# Altium project AUAV X05.PrjPcb (part 1 of 2)
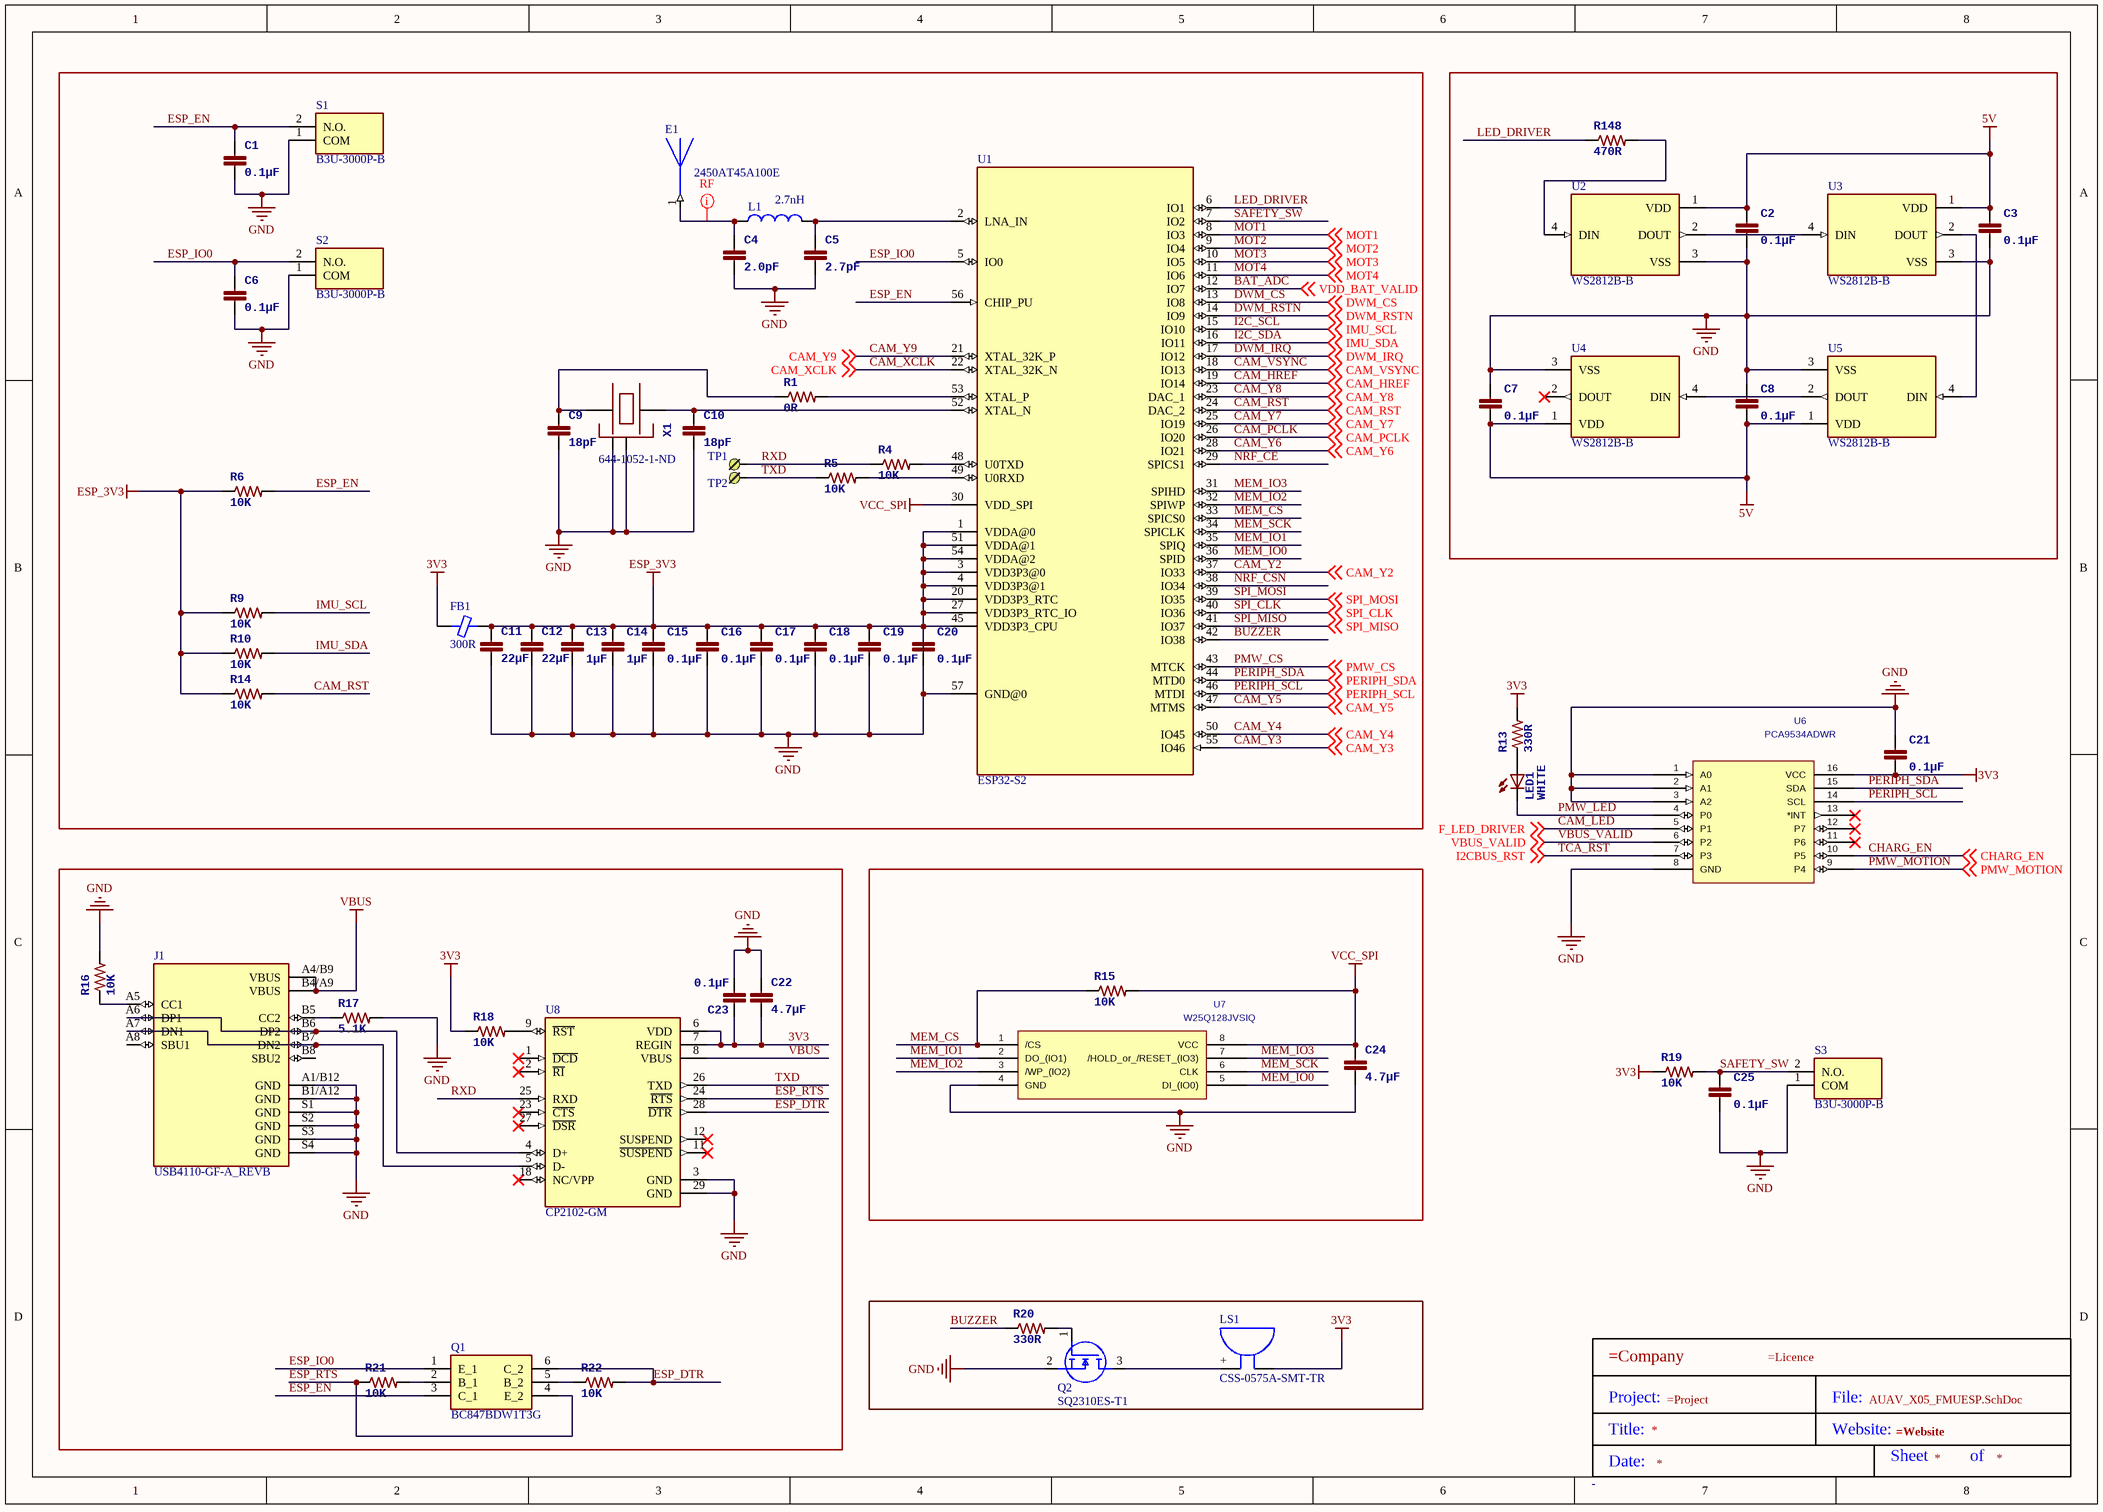
[diagram p0: AUAV_X05_FMUESP.SchDoc]
10 sheets, 386 parts. Net scope: global (net labels, ports and power ports of the same name join across sheets).
Board file: AUAV_X05.PcbDoc
Sheets:
  AUAV_X05_FMUESP.SchDoc
  AUAV_X05_IMU.SchDoc
  AUAV_X05_POWER.SchDoc
  AUAV_X05_CAM.SchDoc
  AUAV_X05_ToF.SchDoc
  AUAV_X05_NRF24.SchDoc
  AUAV_X05_UWB.SchDoc
  AUAV_X05_PMW3901.SchDoc
  AUAV_X05_GPS.SchDoc
  AUAV_X05_ESC.SchDoc

## Sheet AUAV_X05_FMUESP.SchDoc
size A3

### Parts
(Parts that share a designator on the sheet are numbered #1, #2 ... from top to bottom, then left to right.)
*?#1  Title Block  (value not drawn)
C1  0.1µF  [0402-CAP]
C2  0.1µF  [0402-CAP]
C3  0.1µF  [0402-CAP]
C4  2.0pF  [0402-CAP]
C5  2.7pF  [0402-CAP]
C6  0.1µF  [0402-CAP]
C7  0.1µF  [0402-CAP]
C8  0.1µF  [0402-CAP]
C9  18pF  [0402-CAP]
C10  18pF  [0402-CAP]
C11  22µF  [0805-CAP]
C12  22µF  [0805-CAP]
C13  1µF  [0402-CAP]
C14  1µF  [0402-CAP]
C15  0.1µF  [0402-CAP]
C16  0.1µF  [0402-CAP]
C17  0.1µF  [0402-CAP]
C18  0.1µF  [0402-CAP]
C19  0.1µF  [0402-CAP]
C20  0.1µF  [0402-CAP]
C21  0.1µF  [0402-CAP]
C22  4.7µF  [0603-CAP]
C23  0.1µF  [0402-CAP]
C24  4.7µF  [0603-CAP]
C25  0.1µF  [0402-CAP]
E1  2450AT45A100E  [ANT_2450AT45A100E]
FB1  300R  [FER 0402_1005]
J1  USB4110-GF-A_REVB  [GCT_USB4110-GF-A_REVB]
L1  2.7nH  [INDC1005X65N]
LED1  WHITE  [0603-LED]
LS1  CSS-0575A-SMT-TR  [CUI CSS-0575A-SMT-TR]
Q1  BC847BDW1T3G  [SOT65P210X110-6N]
Q2  SQ2310ES-T1  [SOT95P237X112-3N]
R1  0R  [0402-RES]
R4  10K  [0402-RES]
R5  10K  [0402-RES]
R6  10K  [0402-RES]
R9  10K  [0402-RES]
R10  10K  [0402-RES]
R13  330R  [0402-RES]
R14  10K  [0402-RES]
R15  10K  [0402-RES]
R16  10K  [0402-RES]
R17  5.1K  [0402-RES]
R18  10K  [0402-RES]
R19  10K  [0402-RES]
R20  330R  [0402-RES]
R21  10K  [0402-RES]
R22  10K  [0402-RES]
R148  470R  [0402-RES]
S1  B3U-3000P-B  [B3U3000PB]
S2  B3U-3000P-B  [B3U3000PB]
S3  B3U-3000P-B  [B3U3000PB]
TP1  TP  [SMT_PAD]  (value not drawn)
TP2  TP  [SMT_PAD]  (value not drawn)
U1  ESP32-S2  [QFN40P700X700X90-57T400N]
U2  WS2812B-B  [LED_WS2812B-B]
U3  WS2812B-B  [LED_WS2812B-B]
U4  WS2812B-B  [LED_WS2812B-B]
U5  WS2812B-B  [LED_WS2812B-B]
U6  PCA9534ADWR  [DW16]
U7  W25Q128JVSIQ  [SOIC_128JVSIQ_WI]
U8  CP2102-GM  [QFN50P500X500X100-29N]
X1  Supplier Part Number 1: 644-1052-1-ND  [OSCILLATOR-3.2X2.5]  (hidden comment: Crystal Oscillator in 3.2x2.5 SMD)

### Nets
3V3: C21.P$2 C22.P$2 C23.P$1 FB1.1 LS1.- R13.P$2 R18.P$1 R19.P$1 U6.16(VCC) U8.6(VDD) U8.7(REGIN)
5V: C2.P$1 C3.P$1 C7.P$2 C8.P$2 U2.1(VDD) U3.1(VDD) U4.1(VDD) U5.1(VDD)
ESP_3V3: C11.P$1 C12.P$1 C13.P$1 C14.P$1 C15.P$1 C16.P$1 C17.P$1 C18.P$1 C19.P$1 C20.P$1 FB1.2 R6.P$1 R9.P$1 R10.P$1 R14.P$1 U1.1(VDDA@0) U1.3(VDD3P3@0) U1.4(VDD3P3@1) U1.20(VDD3P3_RTC) U1.27(VDD3P3_RTC_IO) U1.45(VDD3P3_CPU) U1.51(VDDA@1) U1.54(VDDA@2)
GND: C1.P$2 C2.P$2 C3.P$2 C4.P$2 C5.P$2 C6.P$2 C7.P$1 C8.P$1 C9.P$2 C10.P$2 C11.P$2 C12.P$2 C13.P$2 C14.P$2 C15.P$2 C16.P$2 C17.P$2 C18.P$2 C19.P$2 C20.P$2 C21.P$1 C22.P$1 C23.P$2 C24.P$2 C25.P$2 J1.A1/B12(GND) J1.B1/A12(GND) J1.S1(GND) J1.S2(GND) J1.S3(GND) J1.S4(GND) Q2.2(S) R16.P$2 R17.P$2 S1.1(COM) S2.1(COM) S3.1(COM) U1.57(GND@0) U2.3(VSS) U3.3(VSS) U4.3(VSS) U5.3(VSS) U6.1(A0) U6.2(A1) U6.3(A2) U6.8(GND) U7.4(GND) U8.3(GND) U8.29(GND) X1.2(NC_2) X1.4(NC_4)
VBUS: J1.A4/B9(VBUS) J1.B4/A9(VBUS) U8.8(VBUS)
VCC_SPI: C24.P$1 R15.P$2 U1.30(VDD_SPI) U7.8(VCC)
BAT_ADC: U1.12(IO7) ; off-sheet VDD_BAT_VALID  [also labelled VDD_BAT_VALID]
BUZZER: R20.P$1 U1.42(IO38)
CAM_HREF: U1.19(IO14) ; off-sheet CAM_HREF
CAM_LED: U6.5(P1) ; off-sheet F_LED_DRIVER  [also labelled F_LED_DRIVER]
CAM_PCLK: U1.26(IO20) ; off-sheet CAM_PCLK
CAM_RST: R14.P$2 U1.24(DAC_2) ; off-sheet CAM_RST
CAM_VSYNC: U1.18(IO13) ; off-sheet CAM_VSYNC
CAM_XCLK: U1.22(XTAL_32K_N) ; off-sheet CAM_XCLK
CAM_Y2: U1.37(IO33) ; off-sheet CAM_Y2
CAM_Y3: U1.55(IO46) ; off-sheet CAM_Y3
CAM_Y4: U1.50(IO45) ; off-sheet CAM_Y4
CAM_Y5: U1.47(MTMS) ; off-sheet CAM_Y5
CAM_Y6: U1.28(IO21) ; off-sheet CAM_Y6
CAM_Y7: U1.25(IO19) ; off-sheet CAM_Y7
CAM_Y8: U1.23(DAC_1) ; off-sheet CAM_Y8
CAM_Y9: U1.21(XTAL_32K_P) ; off-sheet CAM_Y9
CHARG_EN: U6.10(P5) ; off-sheet CHARG_EN
DWM_CS: U1.13(IO8) ; off-sheet DWM_CS
DWM_IRQ: U1.17(IO12) ; off-sheet DWM_IRQ
DWM_RSTN: U1.14(IO9) ; off-sheet DWM_RSTN
ESP_DTR: Q1.6(C_2) R22.P$2 U8.28(~{DTR})
ESP_EN: C1.P$1 Q1.3(C_1) R6.P$2 S1.2(N.O.) U1.56(CHIP_PU)
ESP_IO0: C6.P$1 Q1.1(E_1) S2.2(N.O.) U1.5(IO0)
ESP_RTS: Q1.4(E_2) R21.P$1 U8.24(~{RTS})
I2C_SCL: R9.P$2 U1.15(IO10) ; off-sheet IMU_SCL  [also labelled IMU_SCL]
I2C_SDA: R10.P$2 U1.16(IO11) ; off-sheet IMU_SDA  [also labelled IMU_SDA]
LED_DRIVER: R148.P$1 U1.6(IO1)
MEM_CS: R15.P$1 U1.33(SPICS0) U7.1(/CS)
MEM_IO0: U1.36(SPID) U7.5(DI_(IO0))
MEM_IO1: U1.35(SPIQ) U7.2(DO_(IO1))
MEM_IO2: U1.32(SPIWP) U7.3(/WP_(IO2))
MEM_IO3: U1.31(SPIHD) U7.7(/HOLD_or_/RESET_(IO3))
MEM_SCK: U1.34(SPICLK) U7.6(CLK)
MOT1: U1.8(IO3) ; off-sheet MOT1  [project net ESC1_PWM]
MOT2: U1.9(IO4) ; off-sheet MOT2  [project net ESC2_PWM]
MOT3: U1.10(IO5) ; off-sheet MOT3  [project net ESC3_PWM]
MOT4: U1.11(IO6) ; off-sheet MOT4  [project net ESC4_PWM]
NRF_CE: U1.29(SPICS1)
NRF_CSN: U1.38(IO34)
PERIPH_SCL: U1.46(MTDI) U6.14(SCL) ; off-sheet PERIPH_SCL
PERIPH_SDA: U1.44(MTD0) U6.15(SDA) ; off-sheet PERIPH_SDA
PMW_CS: U1.43(MTCK) ; off-sheet PMW_CS
PMW_LED: LED1.C U6.4(P0)
PMW_MOTION: U6.9(P4) ; off-sheet PMW_MOTION
RXD: R4.P$1 TP1.1 U8.25(RXD)
SAFETY_SW: C25.P$1 R19.P$2 S3.2(N.O.) U1.7(IO2)
SPI_CLK: U1.40(IO36) ; off-sheet SPI_CLK
SPI_MISO: U1.41(IO37) ; off-sheet SPI_MISO
SPI_MOSI: U1.39(IO35) ; off-sheet SPI_MOSI
TCA_RST: U6.7(P3) ; off-sheet I2CBUS_RST  [also labelled I2CBUS_RST]
TXD: R5.P$1 TP2.1 U8.26(TXD)
VBUS_VALID: U6.6(P2) ; off-sheet VBUS_VALID
NetC4_P$1: C4.P$1 E1.1 L1.1
NetC5_P$1: C5.P$1 L1.2 U1.2(LNA_IN)
NetC9_P$1: C9.P$1 R1.P$1 X1.1
NetC10_P$1: C10.P$1 U1.52(XTAL_N) X1.3
NetJ1_A5: J1.A5(CC1) R16.P$1
NetJ1_A6: J1.A6(DP1) J1.B6(DP2) U8.4(D+)
NetJ1_A7: J1.A7(DN1) J1.B7(DN2) U8.5(D-)
NetJ1_B5: J1.B5(CC2) R17.P$1
NetLED1_A: LED1.A R13.P$1
NetLS1_+: LS1.+ Q2.3(D)
NetQ1_2: Q1.2(B_1) R21.P$2
NetQ1_5: Q1.5(B_2) R22.P$1
NetQ2_1: Q2.1(G) R20.P$2
NetR1_P$2: R1.P$2 U1.53(XTAL_P)
NetR4_P$2: R4.P$2 U1.48(U0TXD)
NetR5_P$2: R5.P$2 U1.49(U0RXD)
NetR18_P$2: R18.P$2 U8.9(~{RST})
NetR148_P$2: R148.P$2 U2.4(DIN)
NetU2_2: U2.2(DOUT) U3.4(DIN)
NetU3_2: U3.2(DOUT) U5.4(DIN)
NetU4_4: U4.4(DIN) U5.2(DOUT)

Not connected (* = marked no-connect by the designer): J1 A8(SBU1) B8(SBU2); U4 2(DOUT)*; U6 11(P6)* 12(P7)* 13(*INT)*; U8 1(~{DCD})* 2(~{RI})* 11(~{SUSPEND})* 12(SUSPEND)* 18(NC/VPP)* 23(~{CTS})* 27(~{DSR})*

### Layout directives
net class RF: NetC4_P$1

### Notes on the sheet
- (in symbol Title Block) Project:; File:; Title:; Website:; Sheet; of; Date:

### Library data of the parts
C1-C10 C13-C21 C23 C25 = CAP0402: CAP CER 8PF 50V C0G 0402; PARTNO: C1005C0G1H080C; 3DR_PARTNO: ECM0710; Value: 8p; Supplier 1: Digi-Key; Supplier Part Number 1: 445-4890-1-ND
C11 C12 = CAP0805: CAP CER 4.7UF 16V 10% X7R 0805; PARTNO: CL21B475KOFNNNE; 3DR_PARTNO: ECM0622; Value: 4u7; DATASHEET: http://www.digikey.com/product-detail/en/CL21B475KOFNNNE/1276-2873-2-ND/3888531; Supplier 1: Digi-Key; Supplier Part Number 1: 1276-2873-1-ND
C22 C24 = CAP0603: CAP CER 2.2UF 16V 10% X6S 0603; PARTNO: C1608X6S1C225K080AC; 3DR_PARTNO: ECM0619; Value: 2u2; Supplier 1: Digi-Key; Supplier Part Number 1: 445-7438-1-ND
E1 = 2450AT45A100E: 2.4GHz Chip RF Antenna 2.4GHz ~ 2.5GHz 2.2dBi Solder Surface Mount; MF: Johanson Technology; Price: None; MP: 2450AT45A100E; Value: *; Package: FBGA-1152 Johanson Technology; SnapEDA_Link: https://www.snapeda.com/parts/2450AT45A100E/Johanson%20Technology%20Inc./view-part/105265/?ref=snap; Availability: Unavailable
FB1 = BLM15EX331SN1D: 0402 (1005) 330OHM 25% 1100MA; Manufacturer: Murata Electronics; Current Rating (Max): 1.1A; Filter Type: Signal Line; Number of Lines: 1; Part Number: BLM15EX331SN1D; ComponentLink1Description: Datasheet; ComponentLink1URL: https://www.murata.com/en-us/products/productdata/8796750970910/ENFA0023.pdf; ComponentLink2Description: DigiKey Link; ComponentLink2URL: http://digikey.com/product-detail/en/murata-electronics/BLM15EX331SN1D/490-18371-1-ND/9955444; Device Package: 0402 (1005 Metric); Height (Max): 0.022" (0.55mm); LastUpdated: 02-09-2020 01:18:11; Lifecycle Status: Active; Minimum Order: 1; Mounting Type: Surface Mount; Operating Temperature: -55°C ~ 125°C; Package / Case: 0402 (1005 Metric); Packaging: TapeAndReel; PartId: 364; Part Status: Active; Price: 0.06; Series: *; Size / Dimension: 0.039" L x 0.022" W (1.00mm x 0.55mm); Supplier 1: DigiKey; Supplier Part Number 1: 490-18371-1-ND
J1 = USB4110-GF-A_REVB: USB-C (USB TYPE-C) USB 2.0 Receptacle Connector 24 (16+8 Dummy) Position Surface Mount, Right Angle; Through Hole; MF: GCT; Value: *; Price: None; Package: None; SnapEDA_Link: https://www.snapeda.com/parts/USB4110-GF-A/Global%20Connector%20Technology/view-part/4001167/?ref=snap; Availability: Warning; MP: USB4110-GF-A; Purchase-URL: https://pricing.snapeda.com/search/part/USB4110-GF-A/?ref=eda; Check_prices: https://www.snapeda.com/parts/USB4110-GF-A/Global%20Connector%20Technology/view-part/4001167/?ref=eda
L1 = IND0402: 39nH Unshielded Multilayer Inductor 200mA 1.3Ohm Max 0402 (1005 Metric); MP: AIMC-0402-39NJ-T; MF: Abracon LLC; Package: 0402-2 Abracon; Availability: In Stock; Value: *; SnapEDA_Link: https://www.snapeda.com/parts/AIMC-0402-39NJ-T/Abracon%20LLC/view-part/1612276/?ref=snap; Price: None; Purchase-URL: https://pricing.snapeda.com/search/part/AIMC-0402-39NJ-T/?ref=eda; Check_prices: https://www.snapeda.com/parts/AIMC-0402-39NJ-T/Abracon%20LLC/view-part/1612276/?ref=eda
LED1 = LED0603: LED 1.6X0.8 DOME ORN CLEAR SMD; PARTNO: APTD1608SECK; 3DR_PARTNO: ECM0515; Value: AMBER; Supplier 1: Digi-Key; Supplier Part Number 1: 754-1802-1-ND
LS1 = CSS-0575A-SMT-TR: AUDIO MAGNETIC XDCR 2-4V SMD; Manufacturer: CUI Devices; Current - Supply: 95mA; Driver Circuitry: Transducer, Externally Driven; Frequency: 4kHz; Input Type: Zero-Peak Signal; Operating Mode: Single Tone; Port Location: Top; Sound Pressure Level (SPL): 76dB @ 3V, 10cm; Voltage Range: 2 ~ 4V; Voltage - Rated: 3V; Part Number: CSS-0575A-SMT-TR; ComponentLink1Description: Datasheet; ComponentLink1URL: https://www.cuidevices.com/product/resource/digikeypdf/css-0575a-smt-tr.pdf; ComponentLink2Description: DigiKey Link; ComponentLink2URL: http://digikey.com/product-detail/en/cui-devices/CSS-0575A-SMT-TR/102-2201-1-ND/2364650; Height - Seated (Max): 0.094" (2.40mm); LastUpdated: 24-04-2020 00:39:31; Lifecycle Status: Active; Minimum Order: 1; Mounting Type: Surface Mount; Operating Temperature: -30°C ~ 70°C; Packaging: TapeAndReel; Part Status: Active; Price: 1.50; Series: CSS; Size / Dimension: 0.197" L x 0.197" W (5.00mm x 5.00mm); Supplier 1: DigiKey; Supplier Part Number 1: 102-2201-1-ND; Technology: Magnetic; Termination: Solder Pads
Q1 = BC847BDW1T3G: Transistor BJT NPN; Manufacturer_Name: ON Semiconductor; Datasheet Link: http://www.onsemi.com/pub/Collateral/BC846BDW1T1-D.PDF; Height: 1.1mm; Manufacturer_Part_Number: BC847BDW1T3G; Mouser Part Number: 863-BC847BDW1T3G; Mouser Price/Stock: https://www.mouser.co.uk/ProductDetail/ON-Semiconductor/BC847BDW1T3G?qs=vNc2DXHODiIkZomKfHKn%252Bg%3D%3D; Arrow Part Number: BC847BDW1T3G; Arrow Price/Stock: https://www.arrow.com/en/products/bc847bdw1t3g/on-semiconductor?region=nac
Q2 = SQ2310ES-T1: MOSFET (N-Channel); Manufacturer_Name: Vishay; Datasheet Link: https://www.vishay.com/doc?67036; Height: 1.12mm; Manufacturer_Part_Number: SQ2310ES-T1
R1 R4-R6 R9 R10 R13-R22 R148 = RESISTOR0402-RES: RES 10K OHM 1/16W 1% 0402 SMD; PARTNO: RC0402FR-0710KL; 3DR_PARTNO: ECM0800; Supplier 1: Digi-Key; Value: 10K; Supplier Part Number 1: 311-10.0KLRCT-ND
S1-S3 = B3U-3000P-B: Switch; Manufacturer_Name: Omron Electronics; Datasheet Link: https://componentsearchengine.com/Datasheets/2/B3U-3000P-B.pdf; Height: 1.35mm; Manufacturer_Part_Number: B3U-3000P-B; Mouser Part Number: 653-B3U-3000P-B; Mouser Price/Stock: https://www.mouser.co.uk/ProductDetail/Omron-Electronics/B3U-3000P-B?qs=AO7BQMcsEu4JAdtnbsGArA%3D%3D; Arrow Part Number: B3U-3000P-B; Arrow Price/Stock: https://www.arrow.com/en/products/b3u-3000p-b/omron?region=nac
U1 = ESP32-S2: SMD WI-FI IC, ESP32-S2, SINGAL-C; MF: Espressif Systems; Value: *; Package: None; Price: None; MP: ESP32-S2; Availability: Unavailable; SnapEDA_Link: https://www.snapeda.com/parts/ESP32-S2/Espressif%20Systems/view-part/4571535/?ref=snap
U2-U5 = WS2812B-B: Intelligent control LED integrated light source; MF: Worldsemi; SnapEDA_Link: https://www.snapeda.com/parts/WS2812B-B/Worldsemi/view-part/5799638/?ref=snap; Package: Package; Check_prices: https://www.snapeda.com/parts/WS2812B-B/Worldsemi/view-part/5799638/?ref=eda; Availability: Unavailable; Price: None; MP: WS2812B-B; Value: *
U6 = PCA9534ADWR: Mfr_Name: Texas Instruments; Value: PCA9534ADWR; Copyright: Copyright (C) 2022 Ultra Librarian. All rights reserved.; Manufacturer_Part_Number: PCA9534ADWR; Digi-Key_Part_Number_1: 296-21759-1-ND; Digi-Key_Part_Number_2: 296-21759-2-ND; Digi-Key_Part_Number_3: 296-21759-6-ND; Digi-Key_Part_Number_4: 2156-PCA9534ADWR-ND
U7 = W25Q128JVSIQ: Mfr_Name: Winbond; C: Copyright (C) 2021 Accelerated Designs. All rights reserved; Value: W25Q128JVSIQ; Copyright: Copyright (C) 2022 Ultra Librarian. All rights reserved.; Manufacturer_Part_Number: W25Q128JVSIQ; Digi-Key_Part_Number_1: W25Q128JVSIQ-ND
U8 = CP2102-GM: USB Bridge, USB to UART USB 2.0 UART Interface 28-QFN _5x5_; MF: Silicon Labs; Package: QFN-28 Silicon Labs; Value: *; Price: None; MP: CP2102-GM; Availability: Unavailable; SnapEDA_Link: https://www.snapeda.com/parts/CP2102-GM/Silicon%20Labs/view-part/135876/?ref=snap
X1 = OSCILLATOR-3.2X2.5: CRYSTAL 24MHZ 8PF SMD; 3DR_PARTNO: ECM0708; PARTNO: NX3225SA-24.000MHZ-STD-CSR-1; Supplier 1: Digi-Key; Value: 24MHz
*?#1 = Title Block: Size: -

## Sheet AUAV_X05_IMU.SchDoc
size A4
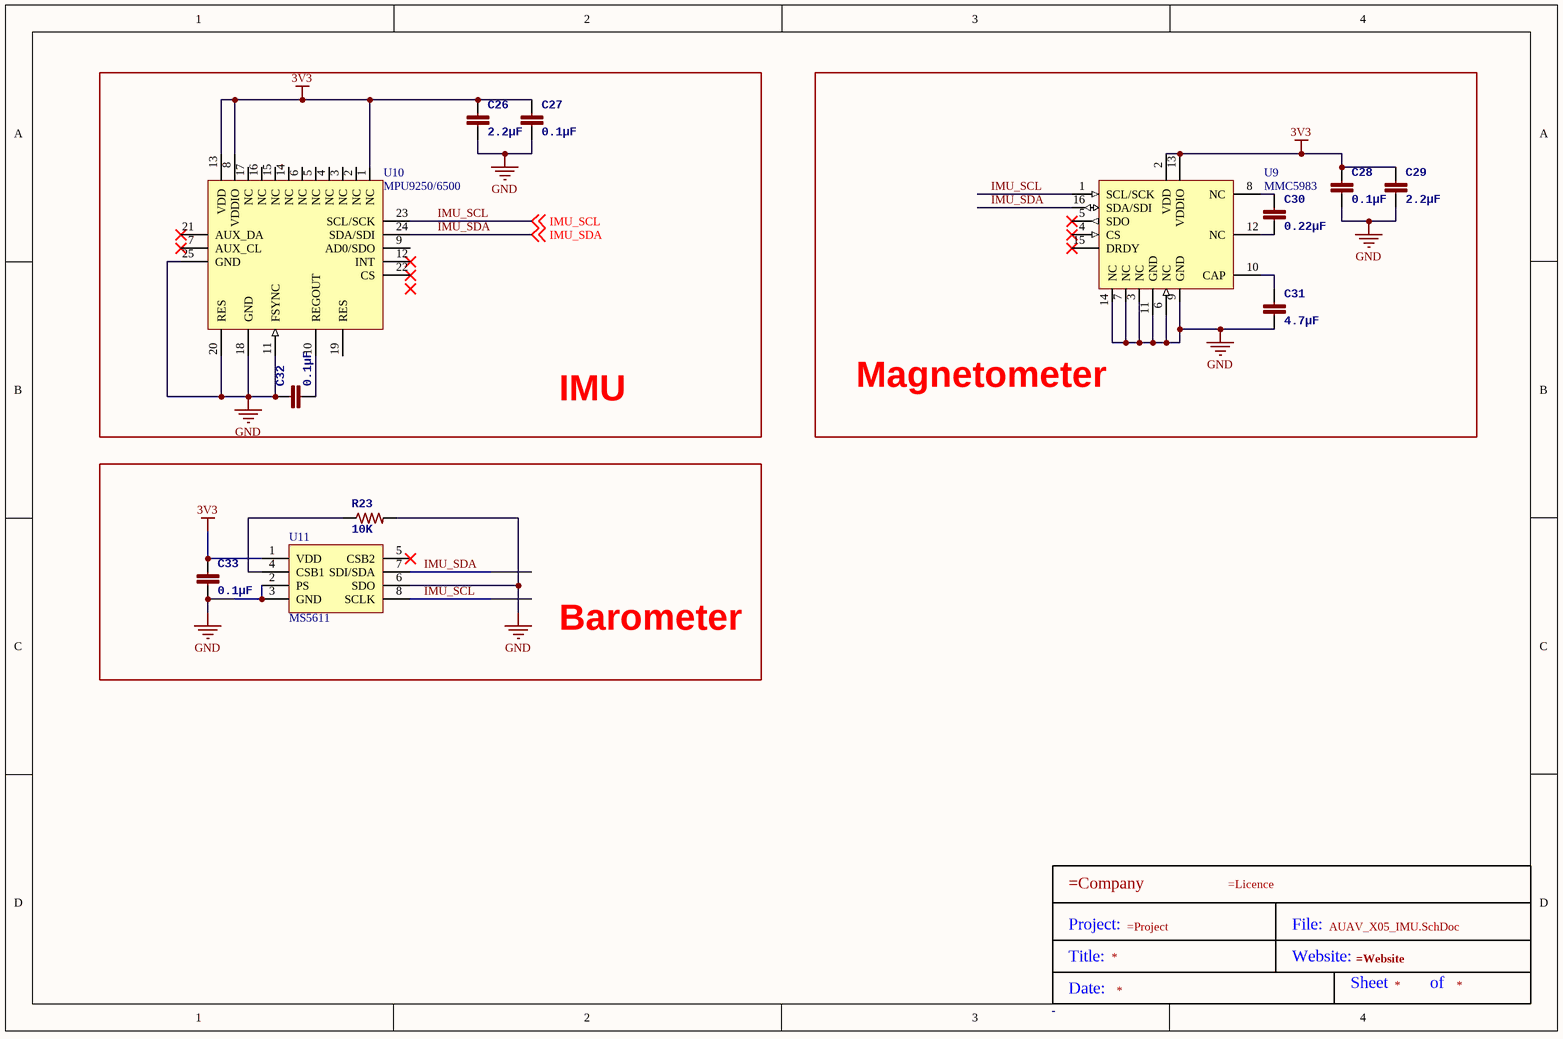
[diagram p1: AUAV_X05_IMU.SchDoc]

### Parts
(Parts that share a designator on the sheet are numbered #1, #2 ... from top to bottom, then left to right.)
*?#2  Title Block  (value not drawn)
C26  2.2µF  [0402-CAP]
C27  0.1µF  [0402-CAP]
C28  0.1µF  [0402-CAP]
C29  2.2µF  [0402-CAP]
C30  0.22µF  [0402-CAP]
C31  4.7µF  [0603-CAP]
C32  0.1µF  [0402-CAP]
C33  0.1µF  [0402-CAP]
R23  10K  [0402-RES]
U9  MMC5983  [MMC5983]
U10  MPU9250/6500  [QFN24_3X3X1_IVS]
U11  MS5611  [MS5611-01BA]

### Blocks framed on the sheet
IMU: C26 C27 C32 U10
Magnetometer: C28-C31 U9
Barometer: C33 R23 U11

### Nets
3V3: C26.P$1 C27.P$1 C28.P$1 C29.P$1 C33.P$1 U9.2(VDD) U9.13(VDDIO) U10.1(NC) U10.8(VDDIO) U10.13(VDD) U11.1(VDD)
GND: C26.P$2 C27.P$2 C28.P$2 C29.P$2 C31.P$2 C32.P$1 C33.P$2 R23.P$2 U9.3(NC) U9.6(NC) U9.7(NC) U9.9(GND) U9.11(GND) U9.14(NC) U10.11(FSYNC) U10.18(GND) U10.20(RES) U10.25(GND) U11.2(PS) U11.3(GND) U11.6(SDO)
IMU_SCL: U9.1(SCL/SCK) U10.23(SCL/SCK) U11.8(SCLK) ; off-sheet IMU_SCL  [project net I2C_SCL]
IMU_SDA: U9.16(SDA/SDI) U10.24(SDA/SDI) U11.7(SDI/SDA) ; off-sheet IMU_SDA  [project net I2C_SDA]
NetC30_P$1: C30.P$1 U9.8(NC)
NetC30_P$2: C30.P$2 U9.12(NC)
NetC31_P$1: C31.P$1 U9.10(CAP)
NetC32_P$2: C32.P$2 U10.10(REGOUT)
NetR23_P$1: R23.P$1 U11.4(CSB1)

Not connected (* = marked no-connect by the designer): U9 4(CS)* 5(SDO)* 15(DRDY)*; U10 2(NC) 3(NC) 4(NC) 5(NC) 6(NC) 7(AUX_CL)* 9(AD0/SDO) 12(INT)* 14(NC) 15(NC) 16(NC) 17(NC) 19(RES) 21(AUX_DA)* 22(CS)*; U11 5(CSB2)*

### Notes on the sheet
- (in symbol Title Block) Project:; File:; Title:; Website:; Sheet; of; Date:

### Library data of the parts
C26-C30 C32 C33 = CAP0402: as C1 on sheet AUAV_X05_FMUESP; Supplier 1: Digi-Key; Supplier Part Number 1: 445-4890-1-ND
C31 = CAP0603: as C22 on sheet AUAV_X05_FMUESP; Supplier 1: Digi-Key; Supplier Part Number 1: 445-7438-1-ND
R23 = RESISTOR0402-RES: as R1 on sheet AUAV_X05_FMUESP; Supplier 1: Digi-Key; Value: 10K; Supplier Part Number 1: 311-10.0KLRCT-ND
U10 = MPU6500
U11 = MS5611-01BA03
*?#2 = Title Block: Size: -

## Sheet AUAV_X05_POWER.SchDoc
size A4
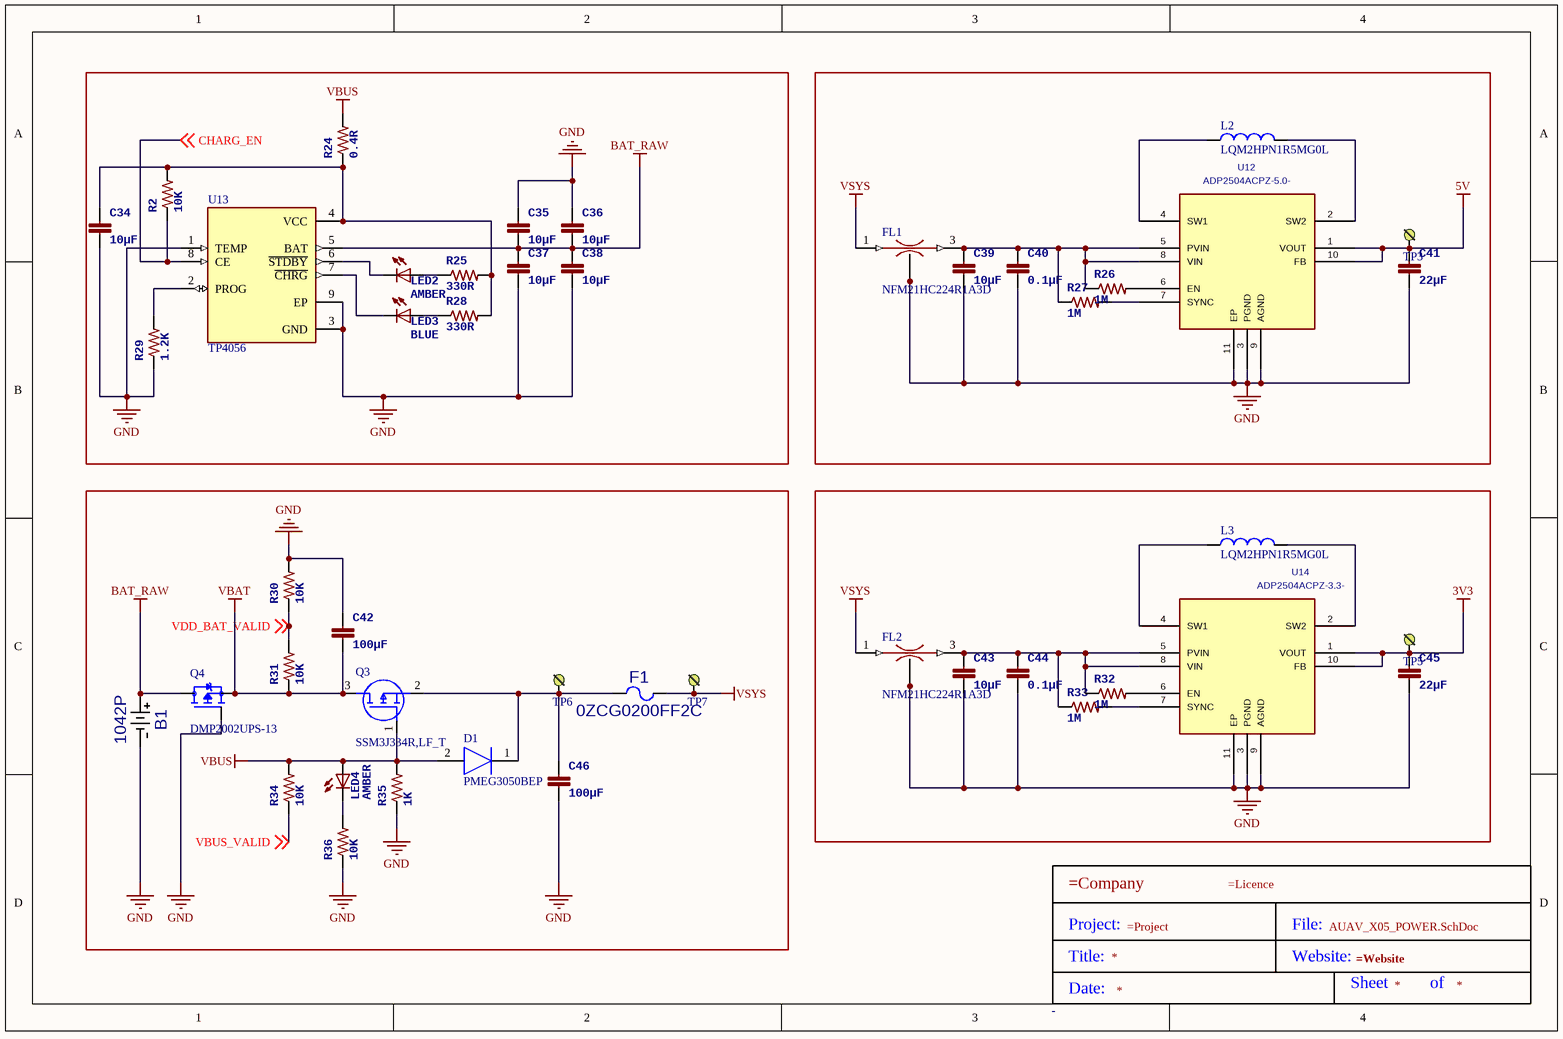
[diagram p2: AUAV_X05_POWER.SchDoc]

### Parts
(Parts that share a designator on the sheet are numbered #1, #2 ... from top to bottom, then left to right.)
*?#3  Title Block  (value not drawn)
B1  1042P  [1042P_KEY]
C34  10µF  [0805-CAP]
C35  10µF  [0805-CAP]
C36  10µF  [0805-CAP]
C37  10µF  [0805-CAP]
C38  10µF  [0805-CAP]
C39  10µF  [0805-CAP]
C40  0.1µF  [0402-CAP]
C41  22µF  [0805-CAP]
C42  100µF  [0805-CAP]
C43  10µF  [0805-CAP]
C44  0.1µF  [0402-CAP]
C45  22µF  [0805-CAP]
C46  100µF  [0805-CAP]
D1  PMEG3050BEP  [PMEG3050EP115]
F1  0ZCG0200FF2C  [0ZCG_BEL]
FL1  NFM21HC224R1A3D  [FIL_NFM21HC224R1A3D]
FL2  NFM21HC224R1A3D  [FIL_NFM21HC224R1A3D]
L2  LQM2HPN1R5MG0L  [INDC2520X100N]
L3  LQM2HPN1R5MG0L  [INDC2520X100N]
LED2  AMBER  [0603-LED]
LED3  BLUE  [0603-LED]
LED4  AMBER  [0603-LED]
Q3  SSM3J334R,LF_T  [SOTFL95P240X88-3N]
Q4  DMP2002UPS-13  [TRANS_DMP2002UPS-13]
R2  10K  [0402-RES]
R24  0.4R  [0402-RES]
R25  330R  [0402-RES]
R26  1M  [0402-RES]
R27  1M  [0402-RES]
R28  330R  [0402-RES]
R29  1.2K  [0402-RES]
R30  10K  [0402-RES]
R31  10K  [0402-RES]
R32  1M  [0402-RES]
R33  1M  [0402-RES]
R34  10K  [0402-RES]
R35  1K  [0402-RES]
R36  10K  [0402-RES]
TP3  TP  [SMT_PAD]  (value not drawn)
TP5  TP  [SMT_PAD]  (value not drawn)
TP6  TP  [SMT_PAD]  (value not drawn)
TP7  TP  [SMT_PAD]  (value not drawn)
U12  ADP2504ACPZ-5.0-  [CP_10_9_ADI]
U13  TP4056  [SOP127P600X175-9N]
U14  ADP2504ACPZ-3.3-  [CP_10_9_ADI]

### Nets
3V3: C45.P$1 TP5.1 U14.1(VOUT) U14.10(FB)
5V: C41.P$1 TP3.1 U12.1(VOUT) U12.10(FB)
BAT_RAW: B1.2 C35.P$2 C36.P$2 C37.P$1 C38.P$1 Q4.5_8(D) U13.5(BAT)
GND: B1.1 C34.P$2 C35.P$1 C36.P$1 C37.P$2 C38.P$2 C39.P$2 C40.P$2 C41.P$2 C42.P$1 C43.P$2 C44.P$2 C45.P$2 C46.P$2 FL1.2(GND) FL1.2_1(GND) FL1.2_2(GND) FL1.2_3(GND) FL1.2_4(GND) FL2.2(GND) FL2.2_1(GND) FL2.2_2(GND) FL2.2_3(GND) FL2.2_4(GND) Q4.4(G) R29.P$1 R30.P$2 R35.P$1 R36.P$1 U12.3(PGND) U12.9(AGND) U12.11(EP) U13.1(TEMP) U13.3(GND) U13.9(EP) U14.3(PGND) U14.9(AGND) U14.11(EP)
VBAT: C42.P$2 Q3.3(D) Q4.1(S) Q4.2(S) Q4.3(S) R31.P$1
VBUS: D1.2(A) LED4.A Q3.1(G) R24.P$2 R34.P$2 R35.P$2
VSYS: F1.2 FL1.1(IN) FL2.1(IN) TP7.1
CHARG_EN: R2.P$1 U13.8(CE) ; off-sheet CHARG_EN
VBUS_VALID: R34.P$1 ; off-sheet VBUS_VALID
VDD_BAT_VALID: R30.P$1 R31.P$2 ; off-sheet VDD_BAT_VALID  [project net BAT_ADC]
NetC34_P$1: C34.P$1 R2.P$2 R24.P$1 R25.P$2 R28.P$2 U13.4(VCC)
NetC39_P$1: C39.P$1 C40.P$1 FL1.3(OUT) R26.P$1 R27.P$1 U12.5(PVIN) U12.8(VIN)
NetC43_P$1: C43.P$1 C44.P$1 FL2.3(OUT) R32.P$1 R33.P$1 U14.5(PVIN) U14.8(VIN)
NetC46_P$1: C46.P$1 D1.1(K) F1.1 Q3.2(S) TP6.1
NetL2_1: L2.1 U12.4(SW1)
NetL2_2: L2.2 U12.2(SW2)
NetL3_1: L3.1 U14.4(SW1)
NetL3_2: L3.2 U14.2(SW2)
NetLED2_A: LED2.A R25.P$1
NetLED2_C: LED2.C U13.6(~{STDBY})
NetLED3_A: LED3.A R28.P$1
NetLED3_C: LED3.C U13.7(~{CHRG})
NetLED4_C: LED4.C R36.P$2
NetR26_P$2: R26.P$2 U12.6(EN)
NetR27_P$2: R27.P$2 U12.7(SYNC)
NetR29_P$2: R29.P$2 U13.2(PROG)
NetR32_P$2: R32.P$2 U14.6(EN)
NetR33_P$2: R33.P$2 U14.7(SYNC)

### Notes on the sheet
- (in symbol Title Block) Project:; File:; Title:; Website:; Sheet; of; Date:

### Library data of the parts
B1 = 1042P: Mfr_Name: Keystone Electronics; C: Copyright (C) 2018 Accelerated Designs. All rights reserved; Copyright: Copyright (C) 2022 Ultra Librarian. All rights reserved.; Manufacturer_Part_Number: 1042P; Value: 1042P
C34-C39 C41-C43 C45 C46 = CAP0805: as C11 on sheet AUAV_X05_FMUESP; DATASHEET: http://www.digikey.com/product-detail/en/CL21B475KOFNNNE/1276-2873-2-ND/3888531; Supplier 1: Digi-Key; Supplier Part Number 1: 1276-2873-1-ND
C40 C44 = CAP0402: as C1 on sheet AUAV_X05_FMUESP; Supplier 1: Digi-Key; Supplier Part Number 1: 445-4890-1-ND
D1 = PMEG3050BEP: Diode; Manufacturer_Name: Nexperia; Datasheet Link: https://assets.nexperia.com/documents/data-sheet/PMEG3050BEP.pdf; Height: 1mm; Manufacturer_Part_Number: PMEG3050BEP; Mouser Part Number: N/A; Mouser Price/Stock: https://www.mouser.com/Search/Refine.aspx?Keyword=N%2FA
F1 = 0ZCG0200FF2C: Mfr_Name: Belfuse; Copyright: Copyright (C) 2022 Ultra Librarian. All rights reserved.; Manufacturer_Part_Number: 0ZCG0200FF2C; Digi-Key_Part_Number_1: 507-1777-1-ND; Digi-Key_Part_Number_2: 507-1777-2-ND; Digi-Key_Part_Number_3: 507-1777-6-ND; Value: 0ZCG0200FF2C
FL1 FL2 = NFM21HC224R1A3D: SMD Capacitor with Capacitance: 0.22uF Tol. 20%. Rated Voltage: 10Vdc; MF: Murata; Digi-Key_Part_Number: 490-14852-1-ND; Package: NONSTANDARD; MP: NFM21HC224R1A3D; Value: *; SnapEDA_Link: https://www.snapeda.com/parts/NFM21HC224R1A3D/Murata/view-part/4381694/?ref=snap
L2 L3 = LQM2HPN1R5MG0L: INDUCTOR, 1.5UH, 20%, 1.5A, 50MHZ, 1008; Package: None; Price: None; Value: *; MP: LQM2HPN1R5MG0L; Availability: Unavailable
LED2 LED4 = LED0603: LED 1.6X0.8 DOME ORN CLEAR SMD; PARTNO: APTD1608SECK; 3DR_PARTNO: ECM0515; Supplier 1: Digi-Key; Value: AMBER; Supplier Part Number 1: 754-1802-1-ND
LED3 = LED0603: as LED1 on sheet AUAV_X05_FMUESP; Supplier 1: Digi-Key; Supplier Part Number 1: 754-1802-1-ND
Q3 = SSM3J334R,LF_T: MOSFET (P-Channel); Manufacturer_Name: Toshiba; Manufacturer_Part_Number: SSM3J334R,LF(T; Datasheet Link: http://toshiba.semicon-storage.com/info/docget.jsp?did=5579&prodName=SSM3J334R; Height: 0.88mm; Arrow Part Number: SSM3J334R,LF(T; Arrow Price/Stock: https://www.arrow.com/en/products/ssm3j334rlf-t/toshiba
Q4 = DMP2002UPS-13: P-Channel 20V 60A (Tc) 2.3W (Ta) Surface Mount PowerDI5060-8 (Type K); MF: Diodes Inc.; Package: PowerTDFN-8 Diodes Incorporated; SnapEDA_Link: https://www.snapeda.com/parts/DMP2002UPS-13/Diodes%20Inc./view-part/761846/?ref=snap; Check_prices: https://www.snapeda.com/parts/DMP2002UPS-13/Diodes%20Inc./view-part/761846/?ref=eda; Value: *; MP: DMP2002UPS-13; Digi-Key_Part_Number: DMP2002UPS-13DICT-ND
R2 R24-R36 = RESISTOR0402-RES: as R1 on sheet AUAV_X05_FMUESP; Supplier 1: Digi-Key; Value: 10K; Supplier Part Number 1: 311-10.0KLRCT-ND
U12 = ADP2504ACPZ-5.0-R7: Mfr_Name: Analog Devices Inc; Value: ADP2504ACPZ-5.0-; Copyright: Copyright (C) 2022 Ultra Librarian. All rights reserved.; Manufacturer_Part_Number: ADP2504ACPZ-5.0-R7
U13 = TP4056: Complete single cell Li-Ion battery with a constant current / constant voltage linear charger; MF: NanJing Top Power ASIC Corp.; Price: None; Availability: No availability data; Value: *; MP: TP4056; Check_prices: https://www.snapeda.com/parts/TP4056%20/NanJing%20Top%20Power%20ASIC%20Corp./view-part/2888426/?ref=eda; SnapEDA_Link: https://www.snapeda.com/parts/TP4056%20/NanJing%20Top%20Power%20ASIC%20Corp./view-part/2888426/?ref=snap; Package: Package
U14 = ADP2504ACPZ-3.3-R7: Mfr_Name: Analog Devices Inc; Value: ADP2504ACPZ-3.3-; Copyright: Copyright (C) 2022 Ultra Librarian. All rights reserved.; Manufacturer_Part_Number: ADP2504ACPZ-3.3-R7
*?#3 = Title Block: Size: -

## Sheet AUAV_X05_CAM.SchDoc
size 209 x 148 mm
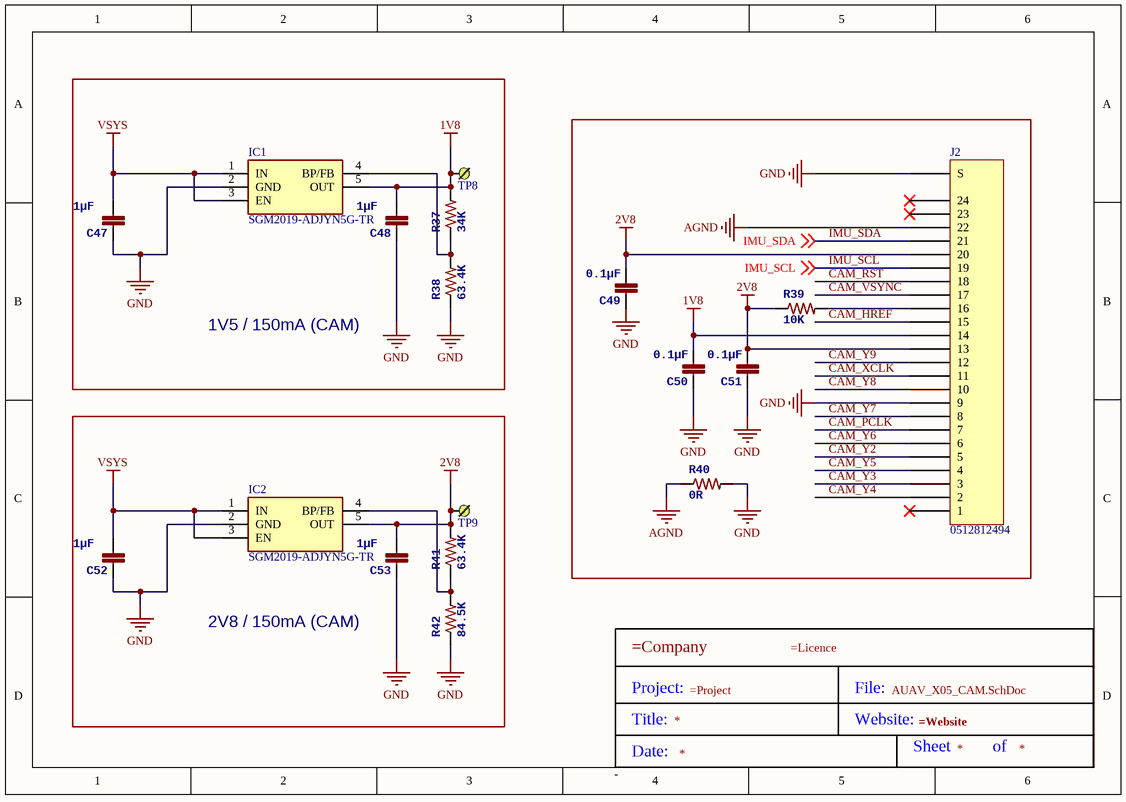
[diagram p3: AUAV_X05_CAM.SchDoc]

### Parts
(Parts that share a designator on the sheet are numbered #1, #2 ... from top to bottom, then left to right.)
*?#4  Title Block  (value not drawn)
C47  1µF  [0402-CAP]
C48  1µF  [0402-CAP]
C49  0.1µF  [0402-CAP]
C50  0.1µF  [0402-CAP]
C51  0.1µF  [0402-CAP]
C52  1µF  [0402-CAP]
C53  1µF  [0402-CAP]
IC1  SGM2019-ADJYN5G-TR  [SOT95P280X125-5N]
IC2  SGM2019-ADJYN5G-TR  [SOT95P280X125-5N]
J2  0512812494  [MOLEX 512812494]
R37  34K  [0402-RES]
R38  63.4K  [0402-RES]
R39  10K  [0402-RES]
R40  0R  [0402-RES]
R41  63.4K  [0402-RES]
R42  84.5K  [0402-RES]
TP8  TP  [SMT_PAD]  (value not drawn)
TP9  TP  [SMT_PAD]  (value not drawn)

### Blocks framed on the sheet
1V5 / 150mA (CAM): C47 C48 IC1 R37 R38 TP8
2V8 / 150mA (CAM): C52 C53 IC2 R41 R42 TP9

### Nets
1V8: C48.P$2 C50.P$2 IC1.5(OUT) J2.14 R37.P$2 TP8.1
2V8: C49.P$2 C51.P$2 C53.P$2 IC2.5(OUT) J2.13 J2.20 R39.P$1 R41.P$2 TP9.1
AGND: J2.22 R40.P$1
GND: C47.P$1 C48.P$1 C49.P$1 C50.P$1 C51.P$1 C52.P$1 C53.P$1 IC1.2(GND) IC2.2(GND) J2.9 J2.S R38.P$1 R40.P$2 R42.P$1
VSYS: C47.P$2 C52.P$2 IC1.1(IN) IC1.3(EN) IC2.1(IN) IC2.3(EN)
CAM_HREF: J2.15
CAM_PCLK: J2.7
CAM_RST: J2.18
CAM_VSYNC: J2.17
CAM_XCLK: J2.11
CAM_Y2: J2.5
CAM_Y3: J2.3
CAM_Y4: J2.2
CAM_Y5: J2.4
CAM_Y6: J2.6
CAM_Y7: J2.8
CAM_Y8: J2.10
CAM_Y9: J2.12
IMU_SCL: J2.19 ; off-sheet IMU_SCL  [project net I2C_SCL]
IMU_SDA: J2.21 ; off-sheet IMU_SDA  [project net I2C_SDA]
NetIC1_4: IC1.4(BP/FB) R37.P$1 R38.P$2
NetIC2_4: IC2.4(BP/FB) R41.P$1 R42.P$2
NetJ2_16: J2.16 R39.P$2

Not connected (* = marked no-connect by the designer): J2 1* 23* 24*

### Notes on the sheet
- (in symbol Title Block) Project:; File:; Title:; Website:; Sheet; of; Date:

### Library data of the parts
C47-C53 = CAP0402: as C1 on sheet AUAV_X05_FMUESP; Supplier 1: Digi-Key; Supplier Part Number 1: 445-4890-1-ND
IC1 IC2 = SGM2019-ADJYN5G-TR: Integrated Circuit; Manufacturer_Name: SGMICRO; Height: 1.25mm; Manufacturer_Part_Number: SGM2019-ADJYN5G-TR
J2 = 0512812494: CONN FFC FPC 24POS 0.50MM R/A; Manufacturer: Molex; Cable End Type: Straight, Tapered; Connector/Contact Type: Contacts, Top and Bottom; FFC, FCB Thickness: 0.30mm; Flat Flex Type: FFC, FPC; Material Flammability Rating: UL94 V-0; Number of Positions: 24; Pitch: 0.020" (0.50mm); Voltage Rating: 50V; Part Number: 0512812494; ComponentLink1Description: Datasheet; ComponentLink1URL: https://www.molex.com/pdm_docs/sd/512810794_sd.pdf; ComponentLink2Description: DigiKey Link; ComponentLink2URL: http://digikey.com/product-detail/en/molex/0512812494/WM6240CT-ND/2185198; Contact Finish: Gold; Contact Material: Phosphor Bronze; Features: Solder Retention; Height Above Board: 0.047" (1.20mm); Housing Material: Liquid Crystal Polymer (LCP), Glass Filled; LastUpdated: 26-05-2020 12:28:11; Lifecycle Status: Active; Minimum Order: 1; Mounting Type: Surface Mount, Right Angle; Operating Temperature: -20°C ~ 85°C; Packaging: TapeAndReel; Part Status: Active; Price: 0.71; Series: 51281; Supplier 1: DigiKey; Supplier Part Number 1: WM6240CT-ND; Termination: Solder
R37-R42 = RESISTOR0402-RES: as R1 on sheet AUAV_X05_FMUESP; Supplier 1: Digi-Key; Value: 10K; Supplier Part Number 1: 311-10.0KLRCT-ND
*?#4 = Title Block: Size: -

## Sheet AUAV_X05_ToF.SchDoc
size A4
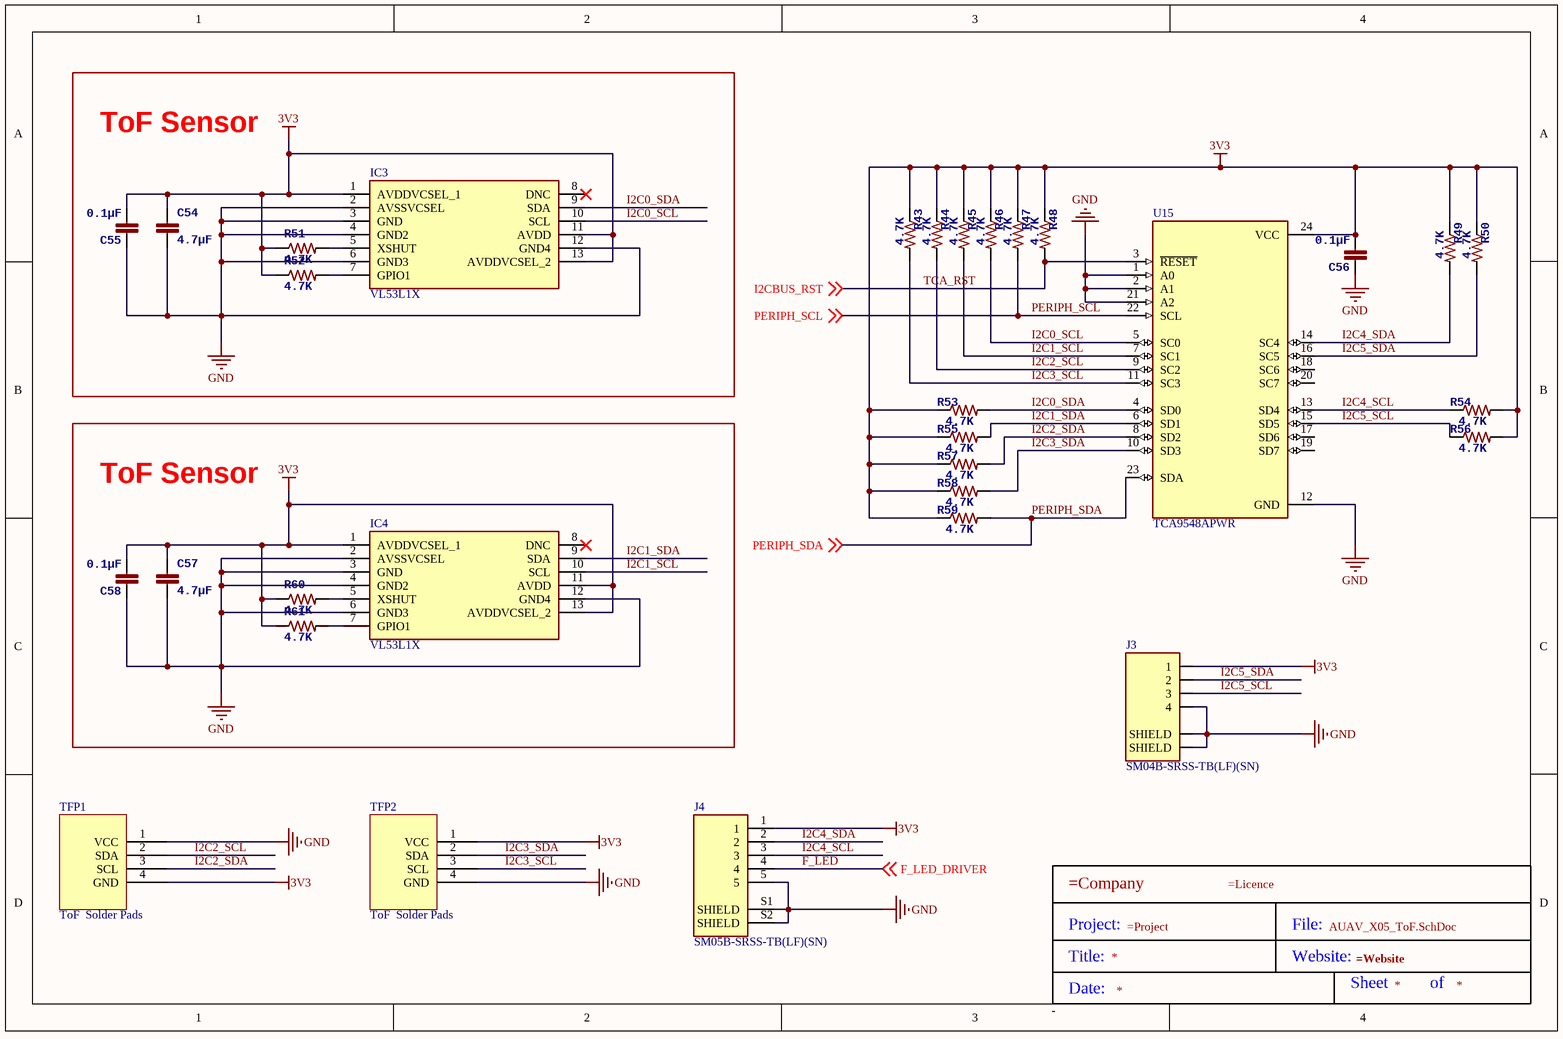
[diagram p4: AUAV_X05_ToF.SchDoc]

### Parts
(Parts that share a designator on the sheet are numbered #1, #2 ... from top to bottom, then left to right.)
*?#5  Title Block  (value not drawn)
C54  4.7µF  [0603-CAP]
C55  0.1µF  [0402-CAP]
C56  0.1µF  [0402-CAP]
C57  4.7µF  [0603-CAP]
C58  0.1µF  [0402-CAP]
IC3  VL53L1X  [VL53L1X]
IC4  VL53L1X  [VL53L1X]
J3  SM04B-SRSS-TB(LF)(SN)  [JST_SM04B-SRSS-TB(LF)(SN)]
J4  SM05B-SRSS-TB(LF)(SN)  [JST_SM05B-SRSS-TB(LF)(SN)]
R43  4.7K  [0402-RES]
R44  4.7K  [0402-RES]
R45  4.7K  [0402-RES]
R46  4.7K  [0402-RES]
R47  4.7K  [0402-RES]
R48  4.7K  [0402-RES]
R49  4.7K  [0402-RES]
R50  4.7K  [0402-RES]
R51  4.7K  [0402-RES]
R52  4.7K  [0402-RES]
R53  4.7K  [0402-RES]
R54  4.7K  [0402-RES]
R55  4.7K  [0402-RES]
R56  4.7K  [0402-RES]
R57  4.7K  [0402-RES]
R58  4.7K  [0402-RES]
R59  4.7K  [0402-RES]
R60  4.7K  [0402-RES]
R61  4.7K  [0402-RES]
TFP1  ToF  Solder Pads  [ToF Pads]
TFP2  ToF  Solder Pads  [ToF Pads]
U15  TCA9548APWR  [SOP65P640X120-24N]

### Blocks framed on the sheet
ToF Sensor: C54 C55 IC3 R51 R52
ToF Sensor: C57 C58 IC4 R60 R61

### Nets
3V3: C54.P$1 C55.P$2 C56.P$2 C57.P$1 C58.P$2 IC3.1(AVDDVCSEL_1) IC3.11(AVDD) IC3.13(AVDDVCSEL_2) IC4.1(AVDDVCSEL_1) IC4.11(AVDD) IC4.13(AVDDVCSEL_2) J3.1 J4.1 R43.P$1 R44.P$1 R45.P$1 R46.P$1 R47.P$1 R48.P$1 R49.P$1 R50.P$1 R51.P$1 R52.P$1 R53.P$1 R54.P$2 R55.P$1 R56.P$2 R57.P$1 R58.P$1 R59.P$1 R60.P$1 R61.P$1 TFP1.4(GND) TFP2.1(VCC) U15.24(VCC)
GND: C54.P$2 C55.P$1 C56.P$1 C57.P$2 C58.P$1 IC3.2(AVSSVCSEL) IC3.3(GND) IC3.4(GND2) IC3.6(GND3) IC3.12(GND4) IC4.2(AVSSVCSEL) IC4.3(GND) IC4.4(GND2) IC4.6(GND3) IC4.12(GND4) J3.4 J3.S1(SHIELD) J3.S2(SHIELD) J4.5 J4.S1(SHIELD) J4.S2(SHIELD) TFP1.1(VCC) TFP2.4(GND) U15.1(A0) U15.2(A1) U15.12(GND) U15.21(A2)
F_LED: J4.4 ; off-sheet F_LED_DRIVER  [also labelled F_LED_DRIVER]  [project net CAM_LED]
I2C0_SCL: IC3.10(SCL) R46.P$2 U15.5(SC0)
I2C0_SDA: IC3.9(SDA) R53.P$2 U15.4(SD0)
I2C1_SCL: IC4.10(SCL) R45.P$2 U15.7(SC1)
I2C1_SDA: IC4.9(SDA) R55.P$2 U15.6(SD1)
I2C2_SCL: R44.P$2 TFP1.2(SDA) U15.9(SC2)
I2C2_SDA: R57.P$2 TFP1.3(SCL) U15.8(SD2)
I2C3_SCL: R43.P$2 TFP2.3(SCL) U15.11(SC3)
I2C3_SDA: R58.P$2 TFP2.2(SDA) U15.10(SD3)
I2C4_SCL: J4.3 R54.P$1 U15.13(SD4)
I2C4_SDA: J4.2 R49.P$2 U15.14(SC4)
I2C5_SCL: J3.3 R56.P$1 U15.15(SD5)
I2C5_SDA: J3.2 R50.P$2 U15.16(SC5)
PERIPH_SCL: R47.P$2 U15.22(SCL) ; off-sheet PERIPH_SCL
PERIPH_SDA: R59.P$2 U15.23(SDA) ; off-sheet PERIPH_SDA
TCA_RST: R48.P$2 U15.3(~{RESET}) ; off-sheet I2CBUS_RST  [also labelled I2CBUS_RST]
NetIC3_5: IC3.5(XSHUT) R51.P$2
NetIC3_7: IC3.7(GPIO1) R52.P$2
NetIC4_5: IC4.5(XSHUT) R60.P$2
NetIC4_7: IC4.7(GPIO1) R61.P$2

Not connected (* = marked no-connect by the designer): IC3 8(DNC)*; IC4 8(DNC)*; U15 17(SD6) 18(SC6) 19(SD7) 20(SC7)

### Notes on the sheet
- (in symbol Title Block) Project:; File:; Title:; Website:; Sheet; of; Date:

### Library data of the parts
C54 C57 = CAP0603: as C22 on sheet AUAV_X05_FMUESP; Supplier 1: Digi-Key; Supplier Part Number 1: 445-7438-1-ND
C55 C56 C58 = CAP0402: as C1 on sheet AUAV_X05_FMUESP; Supplier 1: Digi-Key; Supplier Part Number 1: 445-4890-1-ND
IC3 IC4 = VL53L1X: Integrated Circuit; Manufacturer_Name: STMicroelectronics; Datasheet Link: https://www.st.com/resource/en/datasheet/vl53l1x.pdf; Height: 1.6mm; Manufacturer_Part_Number: VL53L1X
J3 = SM04B-SRSS-TB(LF)(SN): Connector Header Surface Mount, Right Angle 4 position 0.039 _1.00mm_; MF: JST Sales; MP: SM04B-SRSS-TB_LF__SN_; Price: None; SnapEDA_Link: https://www.snapeda.com/parts/SM04B-SRSS-TB%28LF%29%28SN%29/JST%20Sales%20America%20Inc./view-part/557466/?ref=snap; Value: *; Availability: Unavailable; Package: None
J4 = SM05B-SRSS-TB(LF)(SN): Connector Header Surface Mount, Right Angle 5 position 0.039 (1.00mm); MF: JST Sales; Price: None; Value: *; Availability: In Stock; Check_prices: https://www.snapeda.com/parts/SM05B-SRSS-TB(LF)(SN)/JST+Sales+America+Inc./view-part/?ref=eda; SnapEDA_Link: https://www.snapeda.com/parts/SM05B-SRSS-TB(LF)(SN)/JST+Sales+America+Inc./view-part/?ref=snap; MP: SM05B-SRSS-TB(LF)(SN); Package: None
R43-R61 = RESISTOR0402-RES: as R1 on sheet AUAV_X05_FMUESP; Supplier 1: Digi-Key; Value: 10K; Supplier Part Number 1: 311-10.0KLRCT-ND
U15 = TCA9548APWR: Low-Voltage 8-Channel I2C Switch With Reset; MF: Texas Instruments; MP: TCA9548APWR; Price: None; DigiKey-Purchase-URL: https://snapeda.com/shop?store=DigiKey&id=280817; Package: TSSOP-24 Texas Instruments; Mouser-Purchase-URL: https://snapeda.com/shop?store=Mouser&id=280817; Texas_Instruments-Purchase-URL: https://snapeda.com/shop?store=Texas+Instruments&id=280817; Value: *; Availability: Unavailable; Arrow_Electronics-Purchase-URL: https://snapeda.com/shop?store=Arrow+Electronics&id=280817; SnapEDA_Link: https://www.snapeda.com/parts/TCA9548APWR/Texas%20Instruments/view-part/280817/?ref=snap
*?#5 = Title Block: Size: -

## Sheet AUAV_X05_NRF24.SchDoc
size 209 x 148 mm
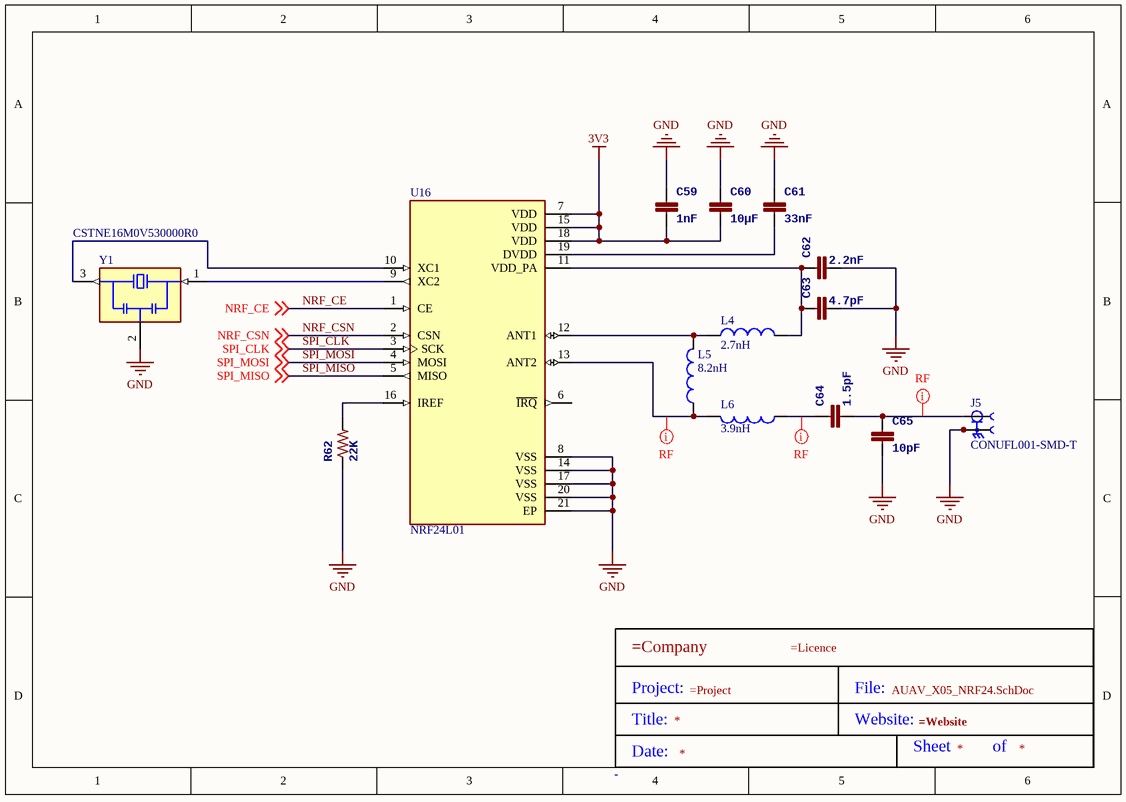
[diagram p5: AUAV_X05_NRF24.SchDoc]

### Parts
(Parts that share a designator on the sheet are numbered #1, #2 ... from top to bottom, then left to right.)
*?#6  Title Block  (value not drawn)
C59  1nF  [0402-CAP]
C60  10µF  [0805-CAP]
C61  33nF  [0402-CAP]
C62  2.2nF  [0402-CAP]
C63  4.7pF  [0402-CAP]
C64  1.5pF  [0402-CAP]
C65  10pF  [0402-CAP]
J5  CONUFL001-SMD-T  [LINX_CONUFL001-SMD-T]
L4  2.7nH  [INDC1005X65N]
L5  8.2nH  [INDC1005X65N]
L6  3.9nH  [INDC1005X65N]
R62  22K  [0402-RES]
U16  NRF24L01  [QFN50P400X400X95-21N]
Y1  CSTNE16M0V530000R0  [OSC_CSTNE16M0V530000R0]

### Nets
3V3: C59.P$2 C60.P$2 U16.7(VDD) U16.15(VDD) U16.18(VDD)
GND: C59.P$1 C60.P$1 C61.P$1 C62.P$2 C63.P$2 C65.P$2 J5.2 J5.3 R62.P$1 U16.8(VSS) U16.14(VSS) U16.17(VSS) U16.20(VSS) U16.21(EP) Y1.2(GND)
NRF_CE: U16.1(CE) ; off-sheet NRF_CE
NRF_CSN: U16.2(CSN) ; off-sheet NRF_CSN
SPI_CLK: U16.3(SCK) ; off-sheet SPI_CLK
SPI_MISO: U16.5(MISO) ; off-sheet SPI_MISO
SPI_MOSI: U16.4(MOSI) ; off-sheet SPI_MOSI
NetC61_P$2: C61.P$2 U16.19(DVDD)
NetC62_P$1: C62.P$1 C63.P$1 L4.2 U16.11(VDD_PA)
NetC64_P$1: C64.P$1 L6.1
NetC64_P$2: C64.P$2 C65.P$1 J5.1
NetL4_1: L4.1 L5.2 U16.12(ANT1)
NetL5_1: L5.1 L6.2 U16.13(ANT2)
NetR62_P$2: R62.P$2 U16.16(IREF)
NetU16_9: U16.9(XC2) Y1.1(IN)
NetU16_10: U16.10(XC1) Y1.3(OUT)

Not connected (* = marked no-connect by the designer): U16 6(~{IRQ})

### Layout directives
net class RF: NetC64_P$1, NetC64_P$2, NetL5_1

### Notes on the sheet
- (in symbol Title Block) Project:; File:; Title:; Website:; Sheet; of; Date:

### Library data of the parts
C59 C61-C65 = CAP0402: as C1 on sheet AUAV_X05_FMUESP; Supplier 1: Digi-Key; Supplier Part Number 1: 445-4890-1-ND
C60 = CAP0805: as C11 on sheet AUAV_X05_FMUESP; DATASHEET: http://www.digikey.com/product-detail/en/CL21B475KOFNNNE/1276-2873-2-ND/3888531; Supplier 1: Digi-Key; Supplier Part Number 1: 1276-2873-1-ND
J5 = CONUFL001-SMD-T: MHF1 Straight Surface Mount Jack, Tape and Reel; MF: Linx Technologies; SnapEDA_Link: https://www.snapeda.com/parts/CONUFL001-SMD-T/Linx+Technologies+Inc./view-part/?ref=snap; Availability: In Stock; Purchase-URL: https://pricing.snapeda.com/search/part/CONUFL001-SMD-T/?ref=eda; MP: CONUFL001-SMD-T; Value: *; Price: None; Package: None; Check_prices: https://www.snapeda.com/parts/CONUFL001-SMD-T/Linx+Technologies+Inc./view-part/?ref=eda
L4-L6 = IND0402: as L1 on sheet AUAV_X05_FMUESP; Package: 0402-2 Abracon; Availability: In Stock; Value: *; SnapEDA_Link: https://www.snapeda.com/parts/AIMC-0402-39NJ-T/Abracon%20LLC/view-part/1612276/?ref=snap; Price: None; Purchase-URL: https://pricing.snapeda.com/search/part/AIMC-0402-39NJ-T/?ref=eda; Check_prices: https://www.snapeda.com/parts/AIMC-0402-39NJ-T/Abracon%20LLC/view-part/1612276/?ref=eda
R62 = RESISTOR0402-RES: as R1 on sheet AUAV_X05_FMUESP; Supplier 1: Digi-Key; Value: 10K; Supplier Part Number 1: 311-10.0KLRCT-ND
U16 = NRF24L01: IC RF TxRx Only General ISM > 1GHZ 2.4GHz 20-VFQFN Exposed Pad; MP: NRF24L01+; MF: Nordic Semiconductor; Availability: Unavailable; Package: QFN-20 Nordic Semiconductor; SnapEDA_Link: https://www.snapeda.com/parts/NRF24L01%2B/Nordic%20Semiconductor%20ASA/view-part/1023904/?ref=snap; Value: *; Price: None
Y1 = CSTNE16M0V530000R0: 16MHz Ceramic Resonator Built in Capacitor 15pF Â±0.3% 40 Ohms -40Â°C ~ 85Â°C Surface Mount; MF: Murata Electronics; Check_prices: https://www.snapeda.com/parts/CSTNE16M0V530000R0/Murata%20Electronics%20North%20America/view-part/2773601/?ref=eda; Purchase-URL: https://pricing.snapeda.com/search/part/CSTNE16M0V530000R0/?ref=eda; SnapEDA_Link: https://www.snapeda.com/parts/CSTNE16M0V530000R0/Murata%20Electronics%20North%20America/view-part/2773601/?ref=snap; Price: None; Value: *; MP: CSTNE16M0V530000R0; Package: SMD-3 Murata; Availability: Warning
*?#6 = Title Block: Size: -

## Sheet AUAV_X05_UWB.SchDoc
size 209 x 148 mm
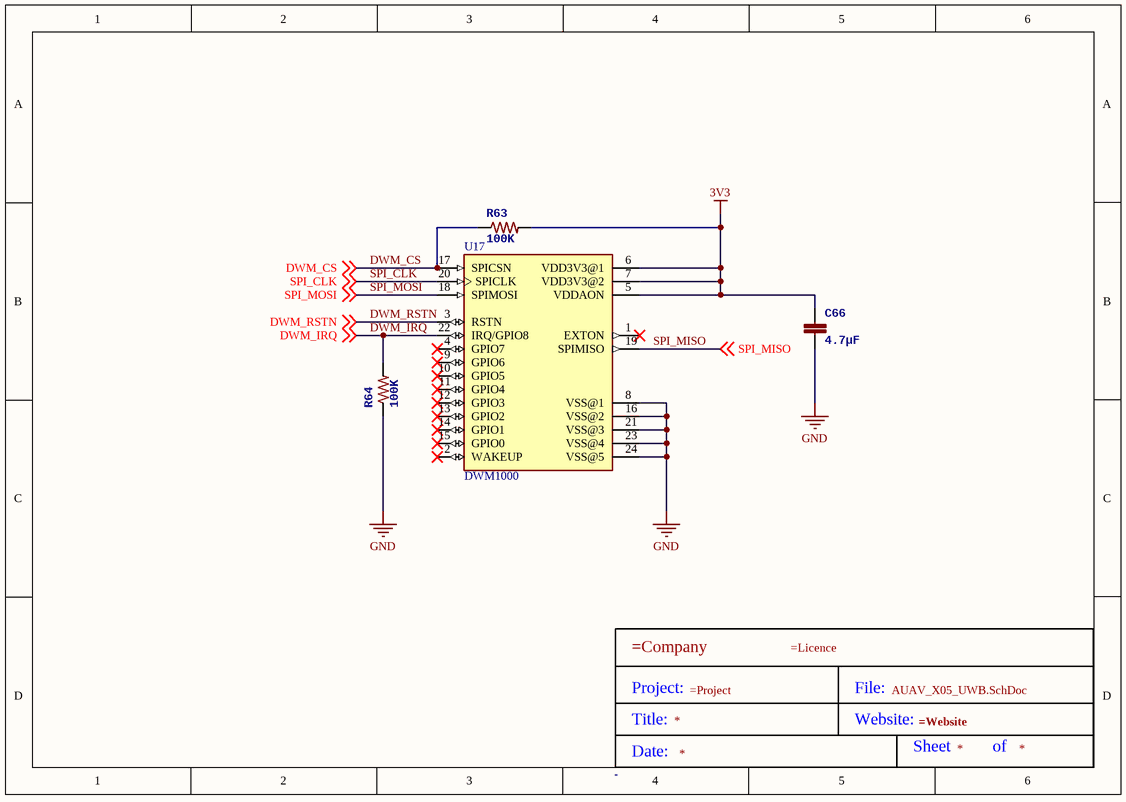
[diagram p6: AUAV_X05_UWB.SchDoc]

### Parts
(Parts that share a designator on the sheet are numbered #1, #2 ... from top to bottom, then left to right.)
*?#7  Title Block  (value not drawn)
C66  4.7µF  [0603-CAP]
R63  100K  [0402-RES]
R64  100K  [0402-RES]
U17  DWM1000  [XCVR_DWM1000]

### Nets
3V3: C66.P$1 R63.P$2 U17.5(VDDAON) U17.6(VDD3V3@1) U17.7(VDD3V3@2)
GND: C66.P$2 R64.P$1 U17.8(VSS@1) U17.16(VSS@2) U17.21(VSS@3) U17.23(VSS@4) U17.24(VSS@5)
DWM_CS: R63.P$1 U17.17(SPICSN) ; off-sheet DWM_CS
DWM_IRQ: R64.P$2 U17.22(IRQ/GPIO8) ; off-sheet DWM_IRQ
DWM_RSTN: U17.3(RSTN) ; off-sheet DWM_RSTN
SPI_CLK: U17.20(SPICLK) ; off-sheet SPI_CLK
SPI_MISO: U17.19(SPIMISO) ; off-sheet SPI_MISO
SPI_MOSI: U17.18(SPIMOSI) ; off-sheet SPI_MOSI

Not connected (* = marked no-connect by the designer): U17 1(EXTON)* 2(WAKEUP)* 4(GPIO7)* 9(GPIO6)* 10(GPIO5)* 11(GPIO4)* 12(GPIO3)* 13(GPIO2)* 14(GPIO1)* 15(GPIO0)*

### Notes on the sheet
- (in symbol Title Block) Project:; File:; Title:; Website:; Sheet; of; Date:

### Library data of the parts
C66 = CAP0603: as C22 on sheet AUAV_X05_FMUESP; Supplier 1: Digi-Key; Supplier Part Number 1: 445-7438-1-ND
R63 R64 = RESISTOR0402-RES: as R1 on sheet AUAV_X05_FMUESP; Supplier 1: Digi-Key; Value: 10K; Supplier Part Number 1: 311-10.0KLRCT-ND
U17 = DWM1000: 802.15.4 IR-UWB Transceiver Module 3.5GHz ~ 6.5GHz Integrated, Chip Surface Mount; MF: Decawave Limited; Package: Module Decawave; Availability: Unavailable; Value: *; MP: DWM1000; SnapEDA_Link: https://www.snapeda.com/parts/DWM1000/Decawave%20Limited/view-part/327593/?ref=snap; Price: None
*?#7 = Title Block: Size: -

## Sheet AUAV_X05_PMW3901.SchDoc
size 209 x 148 mm
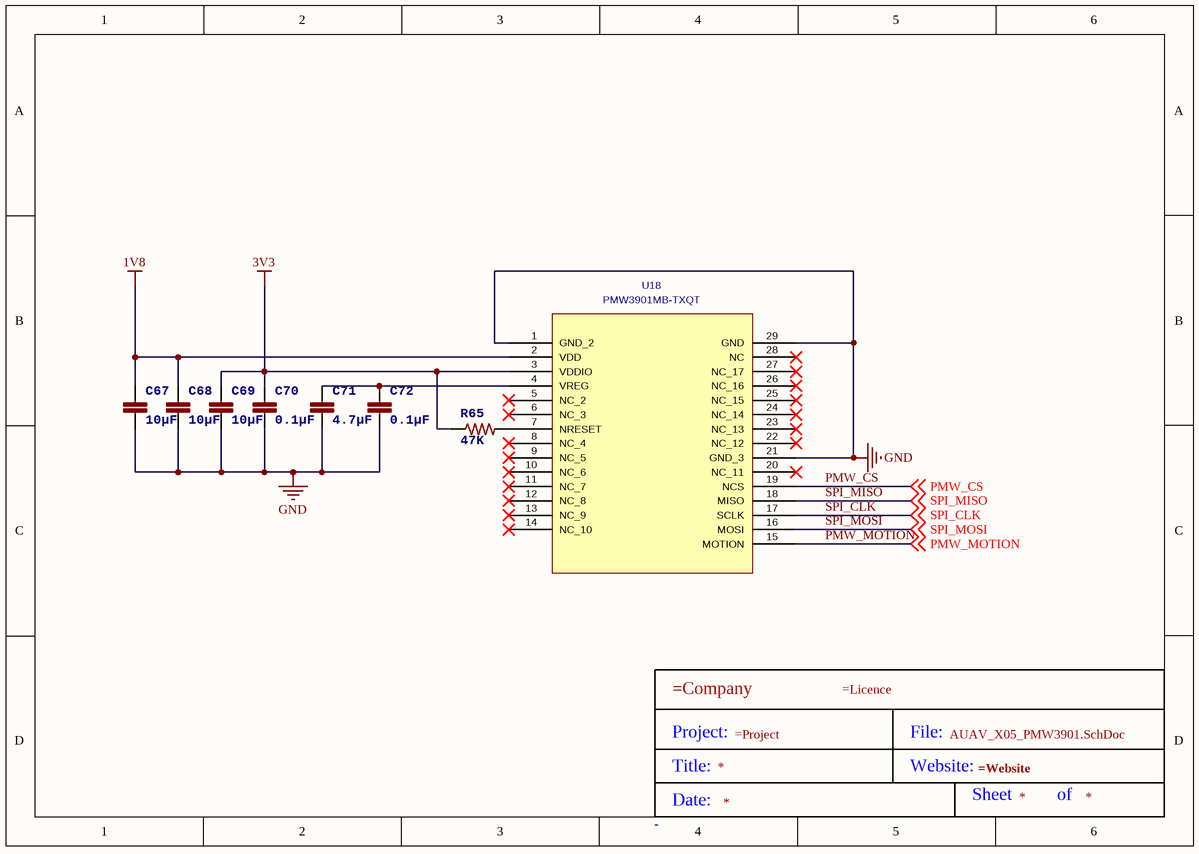
[diagram p7: AUAV_X05_PMW3901.SchDoc]

### Parts
(Parts that share a designator on the sheet are numbered #1, #2 ... from top to bottom, then left to right.)
*?#8  Title Block  (value not drawn)
C67  10µF  [0805-CAP]
C68  10µF  [0805-CAP]
C69  10µF  [0805-CAP]
C70  0.1µF  [0402-CAP]
C71  4.7µF  [0603-CAP]
C72  0.1µF  [0402-CAP]
R65  47K  [0402-RES]
U18  PMW3901MB-TXQT  [QFN_01MB-TXQT_PI]

### Nets
1V8: C67.P$1 C68.P$1 U18.2(VDD)
3V3: C69.P$1 C70.P$1 R65.P$1 U18.3(VDDIO)
GND: C67.P$2 C68.P$2 C69.P$2 C70.P$2 C71.P$2 C72.P$2 U18.1(GND_2) U18.21(GND_3) U18.29(GND)
PMW_CS: U18.19(NCS) ; off-sheet PMW_CS
PMW_MOTION: U18.15(MOTION) ; off-sheet PMW_MOTION
SPI_CLK: U18.17(SCLK) ; off-sheet SPI_CLK
SPI_MISO: U18.18(MISO) ; off-sheet SPI_MISO
SPI_MOSI: U18.16(MOSI) ; off-sheet SPI_MOSI
NetC71_P$1: C71.P$1 C72.P$1 U18.4(VREG)
NetR65_P$2: R65.P$2 U18.7(NRESET)

Not connected (* = marked no-connect by the designer): U18 5(NC_2)* 6(NC_3)* 8(NC_4)* 9(NC_5)* 10(NC_6)* 11(NC_7)* 12(NC_8)* 13(NC_9)* 14(NC_10)* 20(NC_11)* 22(NC_12)* 23(NC_13)* 24(NC_14)* 25(NC_15)* 26(NC_16)* 27(NC_17)* 28(NC)*

### Notes on the sheet
- (in symbol Title Block) Project:; File:; Title:; Website:; Sheet; of; Date:

### Library data of the parts
C67-C69 = CAP0805: as C11 on sheet AUAV_X05_FMUESP; DATASHEET: http://www.digikey.com/product-detail/en/CL21B475KOFNNNE/1276-2873-2-ND/3888531; Supplier 1: Digi-Key; Supplier Part Number 1: 1276-2873-1-ND
C70 C72 = CAP0402: as C1 on sheet AUAV_X05_FMUESP; Supplier 1: Digi-Key; Supplier Part Number 1: 445-4890-1-ND
C71 = CAP0603: as C22 on sheet AUAV_X05_FMUESP; Supplier 1: Digi-Key; Supplier Part Number 1: 445-7438-1-ND
R65 = RESISTOR0402-RES: as R1 on sheet AUAV_X05_FMUESP; Supplier 1: Digi-Key; Value: 10K; Supplier Part Number 1: 311-10.0KLRCT-ND
U18 = PMW3901MB-TXQT: Mfr_Name: PixArt; C: Copyright (C) 2018 Accelerated Designs. All rights reserved; Value: PMW3901MB-TXQT; Copyright: Copyright (C) 2022 Ultra Librarian. All rights reserved.; Manufacturer_Part_Number: PMW3901MB-TXQT
*?#8 = Title Block: Size: -

## Sheet AUAV_X05_GPS.SchDoc
size 209 x 148 mm
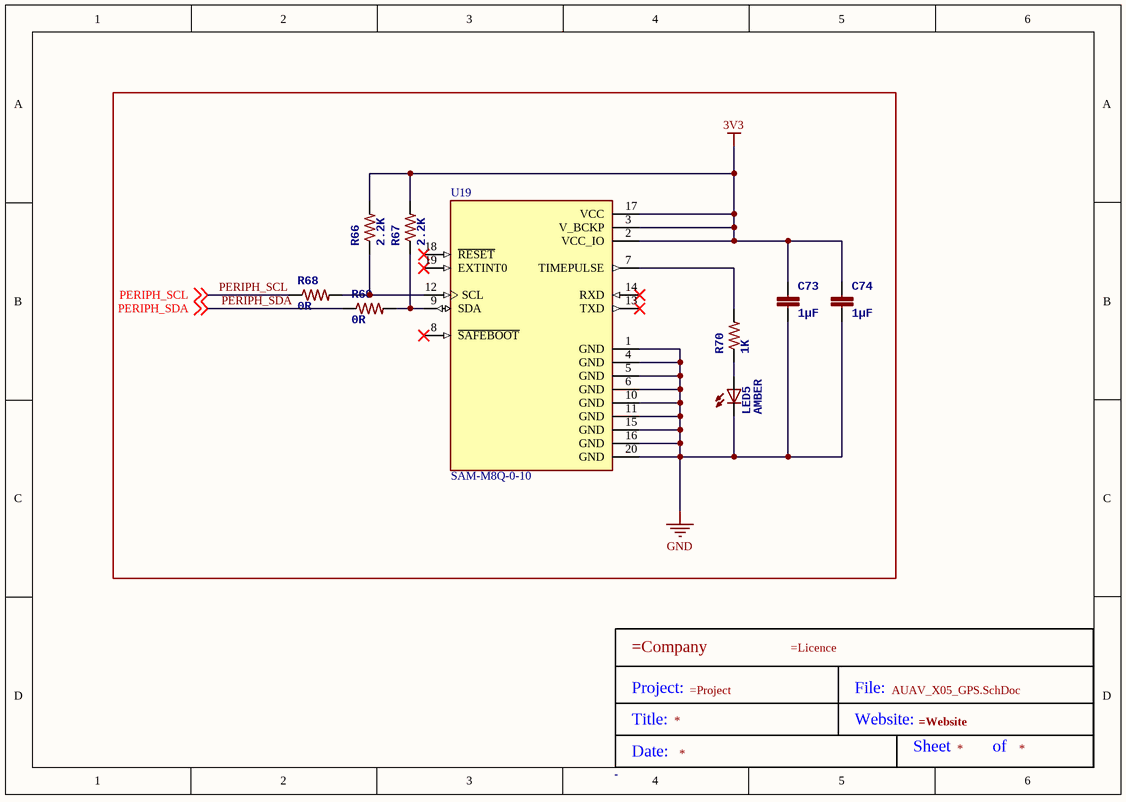
[diagram p8: AUAV_X05_GPS.SchDoc]

### Parts
(Parts that share a designator on the sheet are numbered #1, #2 ... from top to bottom, then left to right.)
*?#9  Title Block  (value not drawn)
C73  1µF  [0402-CAP]
C74  1µF  [0402-CAP]
LED5  AMBER  [0603-LED]
R66  2.2K  [0402-RES]
R67  2.2K  [0402-RES]
R68  0R  [0402-RES]
R69  0R  [0402-RES]
R70  1K  [0402-RES]
U19  SAM-M8Q-0-10  [MODULE_SAM-M8Q-0-10]

### Nets
3V3: C73.P$1 C74.P$1 R66.P$2 R67.P$2 U19.2(VCC_IO) U19.3(V_BCKP) U19.17(VCC)
GND: C73.P$2 C74.P$2 LED5.C U19.1(GND) U19.4(GND) U19.5(GND) U19.6(GND) U19.10(GND) U19.11(GND) U19.15(GND) U19.16(GND) U19.20(GND)
PERIPH_SCL: R68.P$1 ; off-sheet PERIPH_SCL
PERIPH_SDA: R69.P$1 ; off-sheet PERIPH_SDA
NetLED5_A: LED5.A R70.P$1
NetR66_P$1: R66.P$1 R68.P$2 U19.12(SCL)
NetR67_P$1: R67.P$1 R69.P$2 U19.9(SDA)
NetR70_P$2: R70.P$2 U19.7(TIMEPULSE)

Not connected (* = marked no-connect by the designer): U19 8(~{SAFEBOOT})* 13(TXD)* 14(RXD)* 18(~{RESET})* 19(EXTINT0)*

### Notes on the sheet
- (in symbol Title Block) Project:; File:; Title:; Website:; Sheet; of; Date:

### Library data of the parts
C73 C74 = CAP0402: as C1 on sheet AUAV_X05_FMUESP; Supplier 1: Digi-Key; Supplier Part Number 1: 445-4890-1-ND
LED5 = LED0603: as LED2 on sheet AUAV_X05_POWER; Supplier 1: Digi-Key; Value: AMBER; Supplier Part Number 1: 754-1802-1-ND
R66-R70 = RESISTOR0402-RES: as R1 on sheet AUAV_X05_FMUESP; Supplier 1: Digi-Key; Value: 10K; Supplier Part Number 1: 311-10.0KLRCT-ND
U19 = SAM-M8Q-0-10: Concurrent GNSS LGA antenna module, TCXO, SAW, LNA; MF: U-Blox America; SnapEDA_Link: https://www.snapeda.com/parts/SAM-M8Q-0-10/U-Blox%20America%20Inc./view-part/4176901/?ref=snap; Package: SMD-20 u-blox; Check_prices: https://www.snapeda.com/parts/SAM-M8Q-0-10/U-Blox%20America%20Inc./view-part/4176901/?ref=eda; Availability: Not in stock; Price: None; MP: SAM-M8Q-0-10; Value: *
*?#9 = Title Block: Size: -